# Altium schematic sheet OpAmpCircuit.SchDoc
size A; SheetNumber: 1; SheetTotal: 1
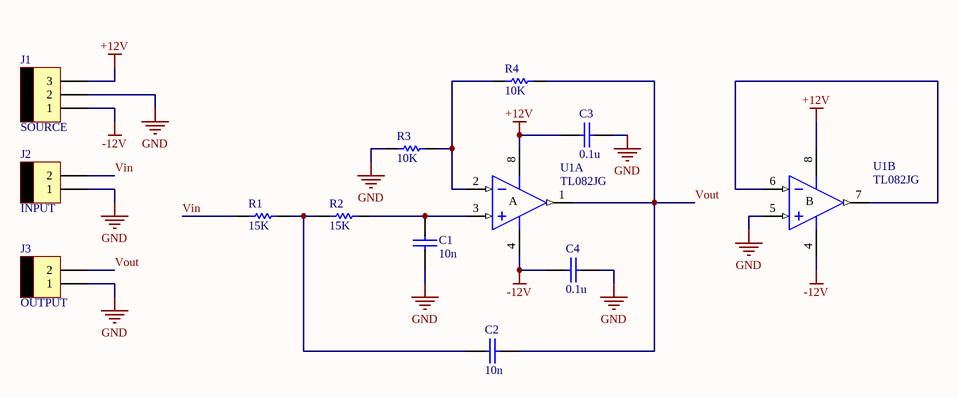
[diagram p0: OpAmpCircuit.SchDoc]

## Parts
C1  10n  [CAP200]
C2  10n  [CAP200]
C3  0.1u  [CAP200]
C4  0.1u  [CAP200]
J1  SOURCE  [MOLEX3]
J2  INPUT  [MOLEX2]
J3  OUTPUT  [MOLEX2]
R1  15K  [RES400]
R2  15K  [RES400]
R3  10K  [RES400]
R4  10K  [RES400]
U1  TL082JG  [JG008]  (parts A,B of 2)

## Nets
+12V: C3.1 J1.3 U1.8(V+)
-12V: C4.1 J1.1 U1.4(V-)
GND: C1.2 C3.2 C4.2 J1.2 J2.1 J3.1 R3.1 U1.5(IN+)
Vin: J2.2 R1.1
Vout: C2.1 J3.2 R4.2 U1.1(OUT)
NetC1_1: C1.1 R2.2 U1.3(IN+)
NetC2_2: C2.2 R1.2 R2.1
NetR3_2: R3.2 R4.1 U1.2(IN-)
NetU1_6: U1.6(IN-) U1.7(OUT)

## Notes on the sheet
- (in symbol TL082JG, part A) A
- (in symbol TL082JG, part B) B

## Library data of the parts
C1-C4 = CAP
J1 = MOLEX3
J2 J3 = MOLEX2
R1-R4 = RES
U1 = TL082JG: JFET-Input Operational Amplifier; Published: 16-Jan-2001; LatestRevisionDate: 04-Mar-2005; LatestRevisionNote: Stylized 3D Model Added.; DatasheetVersion: Feb-1999; PackageVersion: Jan-1995; PackageReference: JG008; Publisher: Altium Limited; PackageDescription: DIP; 8 Leads; Row Spacing 7.62 mm; Pitch 2.54 mm; ComponentLink1Description: Manufacturer Link; ComponentLink1URL: http://www.ti.com/; ComponentLink2Description: Datasheet; ComponentLink2URL: http://www-s.ti.com/sc/ds/tl082.pdf